# Altium schematic sheet PAGE08 System Power.SchDoc
size 297 x 209 mm
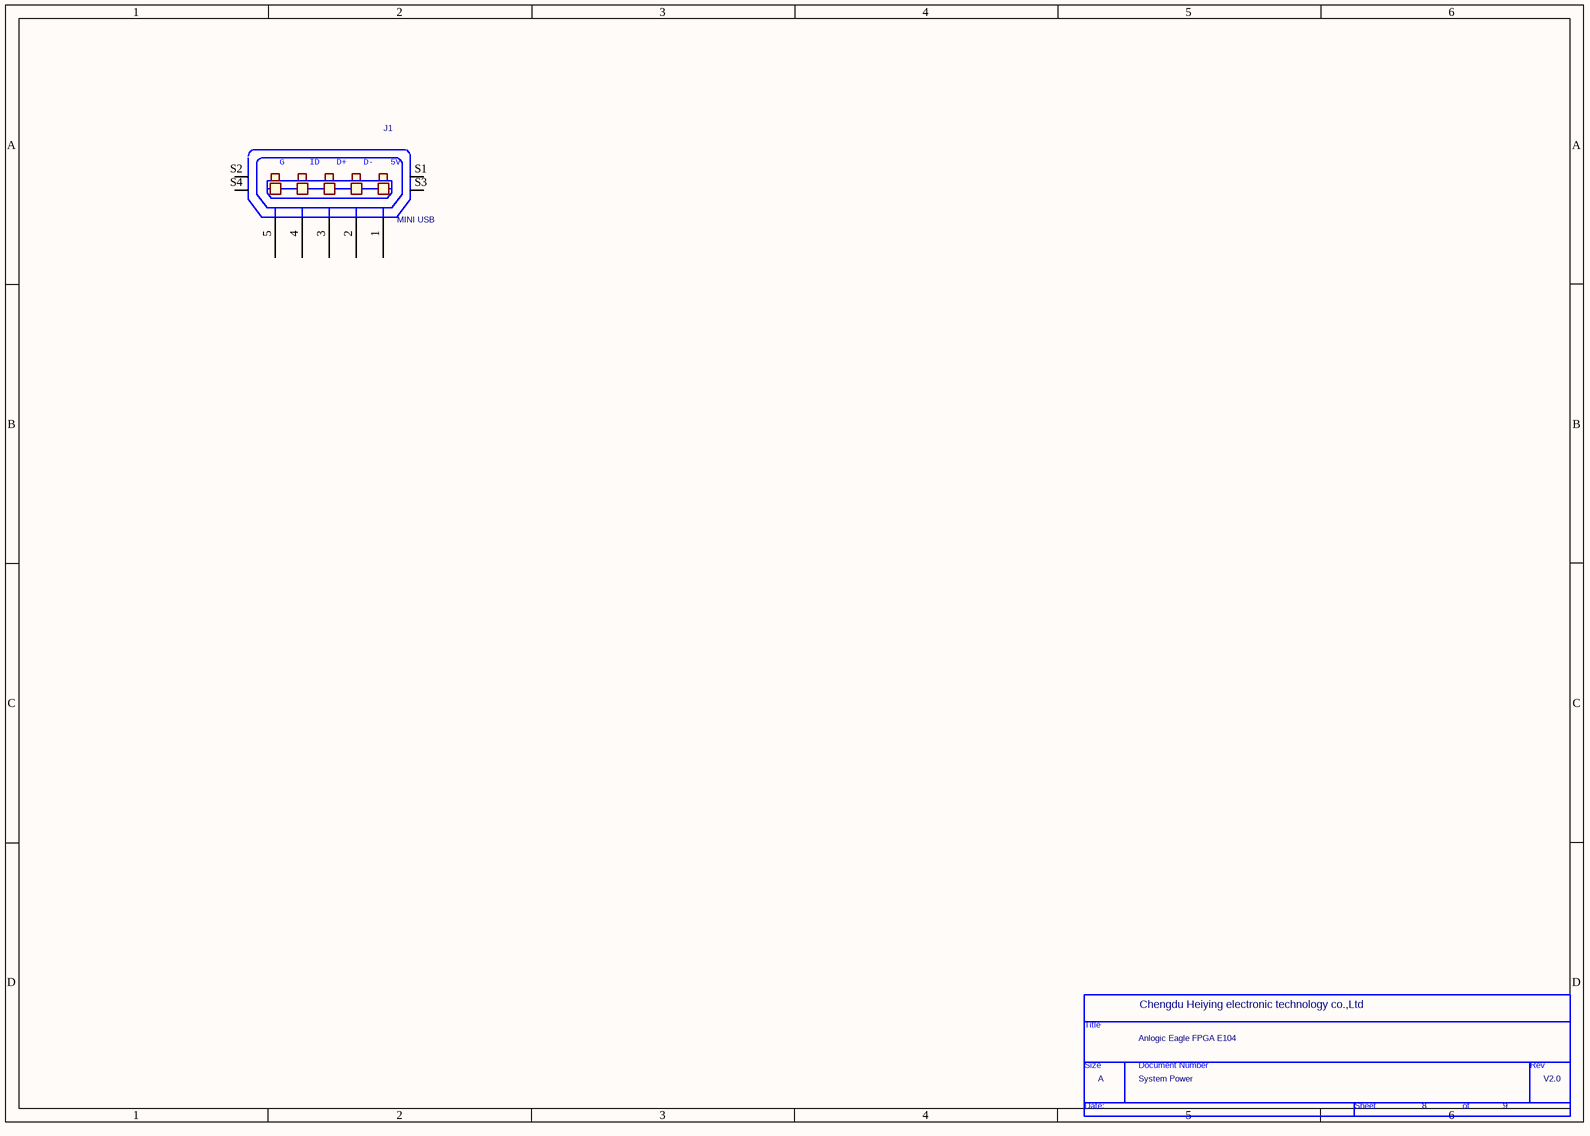
[diagram p0: PAGE08 System Power.SchDoc]

## Parts
*  Page Count: 9  Page Number: 8  Page Size: A  Title: Anlogic Eagle FPGA E104  RevCode: V2.0  Doc: System Power  (hidden comment: TitleBlock0)  (graphical)
J1  MINI USB  [miniusb-ab-sm]

## Nets

Not connected (* = marked no-connect by the designer): J1 1(P1) 2(P2) 3(P3) 4(P4) 5(P5) S1(SHLD1) S2(SHLD2) S3(SHLD3) S4(SHLD4)

## Notes on the sheet
- Chengdu Heiying electronic technology co.,Ltd
- (in symbol TitleBlock0) Title; Size; Document Number; Rev; Date:; Sheet; of
- (in symbol USB_MINI_AB_RECEPTACLE) G; ID; D+; D-; 5V

## Library data of the parts
J1 = USB_MINI_AB_RECEPTACLE: CON 1X5 USB_MICRO_AB_RECEPTACLE RA SMT 0.65MM SP 105H AU; CLASS: IO; AGILE_PN: 211-78722; MFG_NAME01: Molex; MFG_PN01: 47589-0001; CAD_APPROVED: Yes; FPLIST: con5_microusb,con5_microusb_cust; ROHS: Yes; HEIGHT: 2.65MM
* = TitleBlock0: Page Create Date: March  8, 1995